# EAGLE design Cassette Interface (Manchester lm358 lm393) (EAGLE 9.4.2)
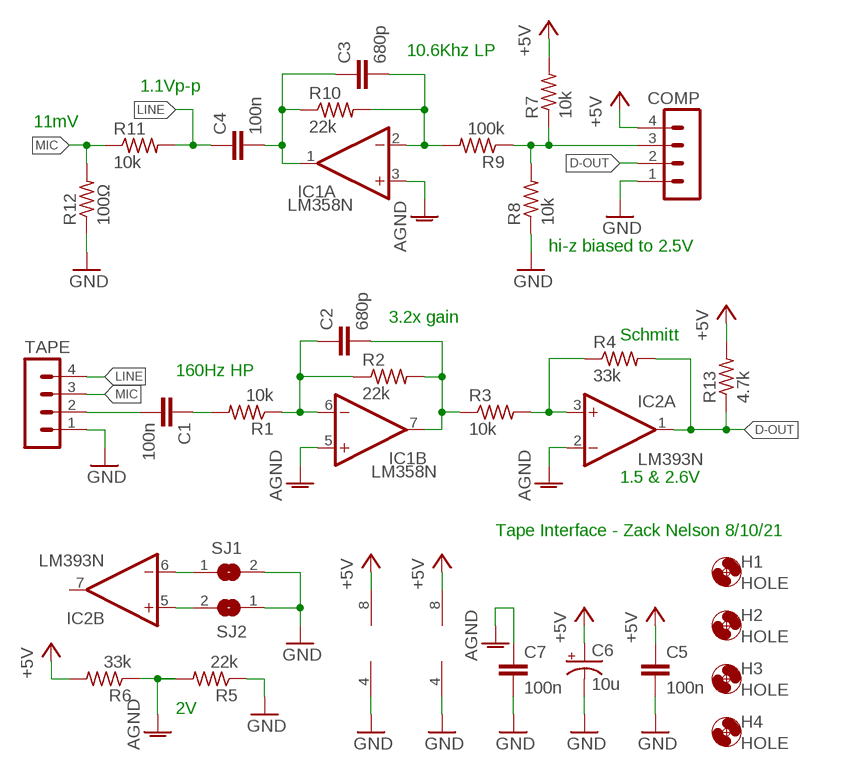
[diagram p0: schematic, sheet 1]

## Parts
C1  100n  C-EU025-024X044  [C025-024X044]
C2  680p  C-EU025-024X044  [C025-024X044]
C3  680p  C-EU025-024X044  [C025-024X044]
C4  100n  C-EU025-024X044  [C025-024X044]
C5  100n  C-EU025-024X044  [C025-024X044]
C6  10u  CPOL-USE2.5-5  [E2,5-5]
C7  100n  C-EU025-024X044  [C025-024X044]
COMP  MA04-1  [MA04-1]
H1  HOLE  MOUNT-HOLE3.0  [3,0]
H2  HOLE  MOUNT-HOLE3.0  [3,0]
H3  HOLE  MOUNT-HOLE3.0  [3,0]
H4  HOLE  MOUNT-HOLE3.0  [3,0]
IC1  LM358N  [DIL08]
IC2  LM393N  [DIL08]
R1  10k  R-US_0204/2V  [0204V]
R2  22k  R-US_0204/2V  [0204V]
R3  10k  R-US_0204/2V  [0204V]
R4  33k  R-US_0204/2V  [0204V]
R5  22k  R-US_0204/2V  [0204V]
R6  33k  R-US_0204/2V  [0204V]
R7  10k  R-US_0204/2V  [0204V]
R8  10k  R-US_0204/2V  [0204V]
R9  100k  R-US_0204/2V  [0204V]
R10  22k  R-US_0204/2V  [0204V]
R11  10k  R-US_0204/2V  [0204V]
R12  100Ω  R-US_0204/2V  [0204V]
R13  4.7k  R-US_0204/2V  [0204V]
SJ1  SJ  [SJ]
SJ2  SJ  [SJ]
TAPE  MA04-1  [MA04-1]

## Nets
+5V [power]: C5.1 C6.+ COMP.4 IC1.8(P:V+) IC2.8(P:V+) R6.2 R7.2 R13.2
AGND [power]: C7.1 IC1.3(A:+IN) IC1.5(B:+IN) IC2.2(A:-IN) R5.2 R6.1
D-IN: COMP.3 R7.1 R8.2 R9.1
D-OUT: COMP.2 IC2.1(A:OUT) R4.2 R13.1
GND [power]: C5.2 C6.- C7.2 COMP.1 IC1.4(P:V-) IC2.4(P:V-) R5.1 R8.1 R12.1 SJ1.2 SJ2.1 TAPE.1
LINE: C4.1 R11.2 TAPE.4
MIC: R11.1 R12.2 TAPE.3
N$1: C1.1 R1.2
N$2: C2.1 IC1.6(B:-IN) R1.1 R2.1
N$3 [power]: IC2.6(B:-IN) SJ1.1
N$4: C2.2 IC1.7(B:OUT) R2.2 R3.1
N$5 [power]: IC2.5(B:+IN) SJ2.2
N$7: IC2.3(A:+IN) R3.2 R4.1
N$8: C3.2 IC1.2(A:-IN) R9.2 R10.2
N$10: C3.1 C4.2 IC1.1(A:OUT) R10.1
TAPE-IN: C1.2 TAPE.2
Unconnected: IC2.7(B:OUT)

## Notes on the sheet
- 10.6Khz LP
- 1.1Vp-p
- 11mV
- hi-z biased to 2.5V
- 3.2x gain
- Schmitt
- 160Hz HP
- 1.5 & 2.6V
- Tape Interface - Zack Nelson 8/10/21
- 2V

## Library data of the parts
C1-C5 C7 = rcl:C-EU: CAPACITOR, European symbol; SPICEPREFIX: C
C6 = rcl:CPOL-US: POLARIZED CAPACITOR, American symbol; SPICEPREFIX: C
COMP TAPE = con-lstb:MA04-1: PIN HEADER; OC_FARNELL: unknown; OC_NEWARK: unknown
H1-H4 = holes:MOUNT-HOLE: MOUNTING HOLE with drill center marker
IC1 = linear (LM567):LM358: OP AMP also LM158; LM258; LM2904 Source: http://cache.national.com/ds/LM/LM158.pdf
IC2 = linear (LM567):LM393: COMPARATOR
R1-R13 = rcl:R-US_: RESISTOR, American symbol; SPICEPREFIX: R
SJ1 SJ2 = jumper:SJ: SMD solder JUMPER

## Net classes
1 power: width 0.508 mm

## Board
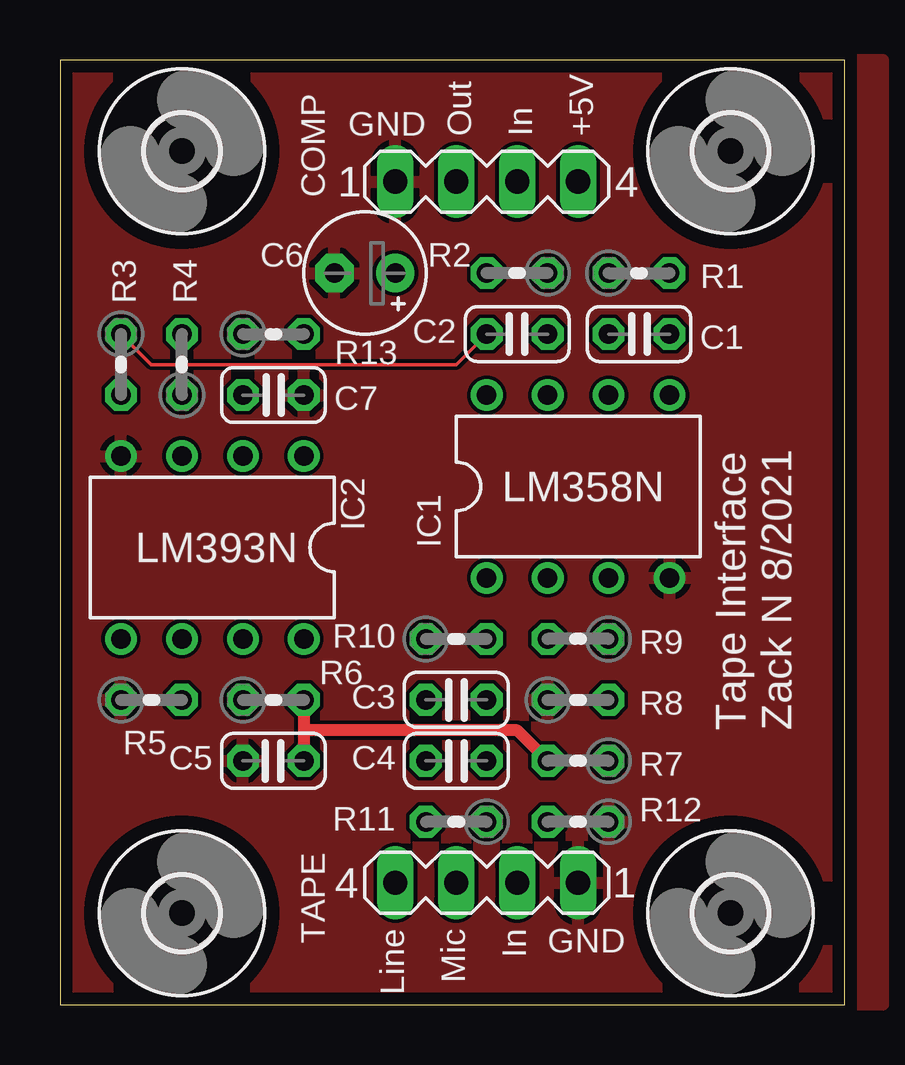
[diagram p1: board, top side]
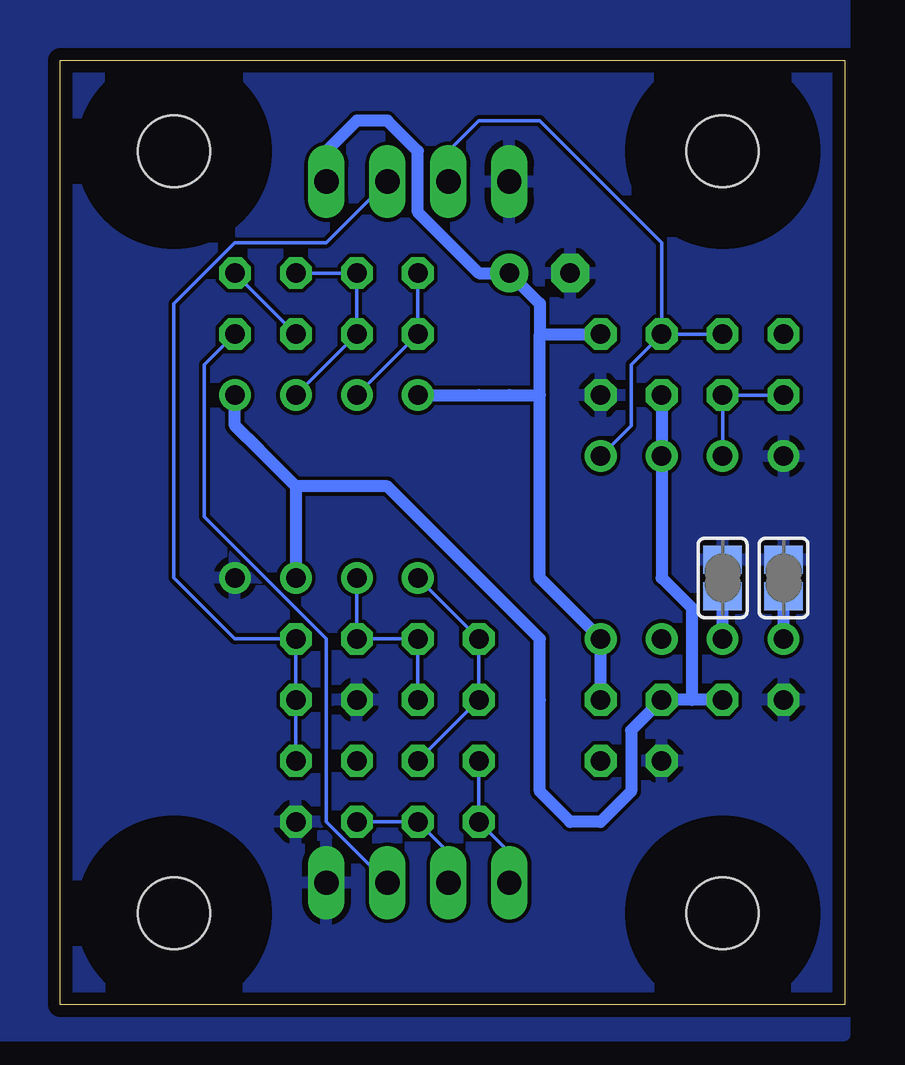
[diagram p2: board, bottom side, seen from below]

Size 32.69 x 39.36 mm. Coordinates in mm from the lower left corner, seen from the top.
Outline: 0,0 32.69,0 32.69,39.36 0,39.36 0,0
Copper layers (1*16): Top 0.035mm / dielectric 1.5mm / Bottom 0.035mm
Design rules "default *": minimum track width 6mil, minimum drill 0.35mm, track to track 6mil, track to pad 6mil, pad to pad 6mil, via to via 6mil, smd to smd 6mil, copper to edge 20mil, drill to drill 6mil, minimum pad ring 10mil, minimum via ring 8mil, stop-mask expansion 4mil, vias tented up to drill 0mil, thermal gap 10mil

### Footprints (pad centres in the part's own frame; a part is rotated, then mirrored left to right if it is on the bottom)
C025-024X044 = drill 0.813 octagon: 1 -1.27,0; 2 1.27,0
E2,5-5 = drill 0.813 pad 1.6: + -1.27,0 | drill 0.813 pad 1.6 octagon: - 1.27,0
MA04-1 = drill 1.016 long: 1 -3.81,0; 2 -1.27,0; 3 1.27,0; 4 3.81,0
3,0 = hole 3: 0,0
DIL08 = drill 0.813 pad 1.27: 1 -3.81,-3.81; 2 -1.27,-3.81; 3 1.27,-3.81; 4 3.81,-3.81; 5 3.81,3.81; 6 1.27,3.81; 7 -1.27,3.81; 8 -3.81,3.81
0204V = drill 0.813 octagon: 1 -1.27,0; 2 1.27,0
SJ = smd 1.168 x 1.6: 1 -0.762,0; 2 0.762,0

### Placement (x,y rotation side)
C1  24.13,27.94 0 top
C2  19.05,27.94 180 top
C3  16.51,12.7 0 top
C4  16.51,10.16 0 top
C5  8.89,10.16 180 top
C6  12.7,30.48 180 top
C7  8.89,25.4 0 top
COMP  17.78,34.29 0 top
H1  5.08,3.81 0 top
H2  27.94,3.81 0 top
H3  27.94,35.56 0 top
H4  5.08,35.56 0 top
IC1  21.59,21.59 0 top
IC2  6.35,19.05 180 top
R1  24.13,30.48 0 top
R2  19.05,30.48 180 top
R3  2.54,26.67 270 top
R4  5.08,26.67 90 top
R5  3.81,12.7 0 top
R6  8.89,12.7 0 top
R7  21.59,10.16 180 top
R8  21.59,12.7 0 top
R9  21.59,15.24 180 top
R10  16.51,15.24 0 top
R11  16.51,7.62 180 top
R12  21.59,7.62 180 top
R13  8.89,27.94 0 top
SJ1  5.08,17.78 90 bottom
SJ2  2.54,17.78 270 bottom
TAPE  17.78,5.08 180 top

### Tracks (layer width: path | path; a pad name or v marks a point on that pad's centre or on a via)
+5V
  Top 0.508: R7.2 19.05,11.43 10.16,11.43 | R6.2 10.16,11.43 | 10.16,11.43 C5.1
  Bottom 0.508: R6.2 IC2.8 12.7,17.78 12.7,25.4 | 12.7,27.94 R13.2 | IC1.8 15.24,25.4 13.97,25.4 12.7,25.4 | COMP.4 21.59,35.56 20.32,36.83 19.05,36.83 17.78,35.56 17.78,33.02 15.24,30.48 C6.+ 12.7,29.21 12.7,27.94 | 12.7,25.4 12.7,27.94
AGND
  Bottom 0.508: R5.2 6.35,12.7 | 6.35,12.7 R6.1 8.89,11.43 8.89,8.89 10.16,7.62 11.43,7.62 12.7,8.89 12.7,12.7 12.7,15.24 19.05,21.59 22.86,21.59 | 6.35,12.7 6.35,16.51 7.62,17.78 IC2.2 C7.1 | 22.86,21.59 24.36,23.09 25.4,24.13 IC1.5 | 22.86,21.59 IC1.3
D-IN
  Bottom 0.152: R7.1 R8.2 R9.1 25.4,15.24 27.94,17.78 27.94,29.21 26.67,30.48 25.4,31.75 21.59,31.75 COMP.3
D-OUT
  Bottom 0.152: IC2.1 8.89,24.13 8.89,26.67 R13.1 | R13.1 R4.2 | COMP.2 16.51,35.56 15.24,36.83 12.7,36.83 7.62,31.75 R13.1
GND
  pour Bottom: 0,41.91 35.56,41.91 35.56,-1.27 0,-1.27
  pour Bottom: 0,43.18 34.29,43.18 34.29,-1.27 0,-1.27
  pour Top: 0,39.37 34.29,39.37 34.29,0 0,0
LINE
  Bottom 0.152: TAPE.4 13.97,6.35 R11.2 C4.1
MIC
  Bottom 0.152: R12.2 R11.1 16.51,6.35 TAPE.3
N$1
  Bottom 0.152: C1.1 R1.2
N$2
  Bottom 0.152: IC1.6 C2.1 R2.1 R1.1
N$3
  Bottom 0.152: 5.08,18.41 5.08,16.51
  Bottom 0.508: IC2.6 5.08,16.51 SJ1.1
N$4
  Top 0.152: C2.2 16.51,26.67 3.81,26.67 R3.1
  Bottom 0.152: R2.2 C2.2 IC1.7
N$5
  Bottom 0.152: 2.54,18.41 2.54,16.51
  Bottom 0.508: IC2.5 2.54,16.51 SJ2.2
N$7
  Bottom 0.152: R3.2 R4.1 IC2.3
N$8
  Bottom 0.152: C3.2 R10.2 R9.2 IC1.2
N$10
  Bottom 0.152: IC1.1 R10.1 C3.1 C4.2
TAPE-IN
  Bottom 0.152: C1.2 26.67,26.67 26.67,20.32 21.59,15.24 21.59,7.62 TAPE.2

### Text on the board
tNames: GND | Out | In | +5V | Tape Interface / Zack N 8/2021 | Line | Mic | In | GND